# Altium schematic sheet Drone Connector.SchDoc
size A4; Organization: Altium Limited; Address1: L3, 12a Rodborough Rd; Address2: Frenchs Forest; Address3: NSW; Address4: Australia 2086; SheetNumber: 1; SheetTotal: 3
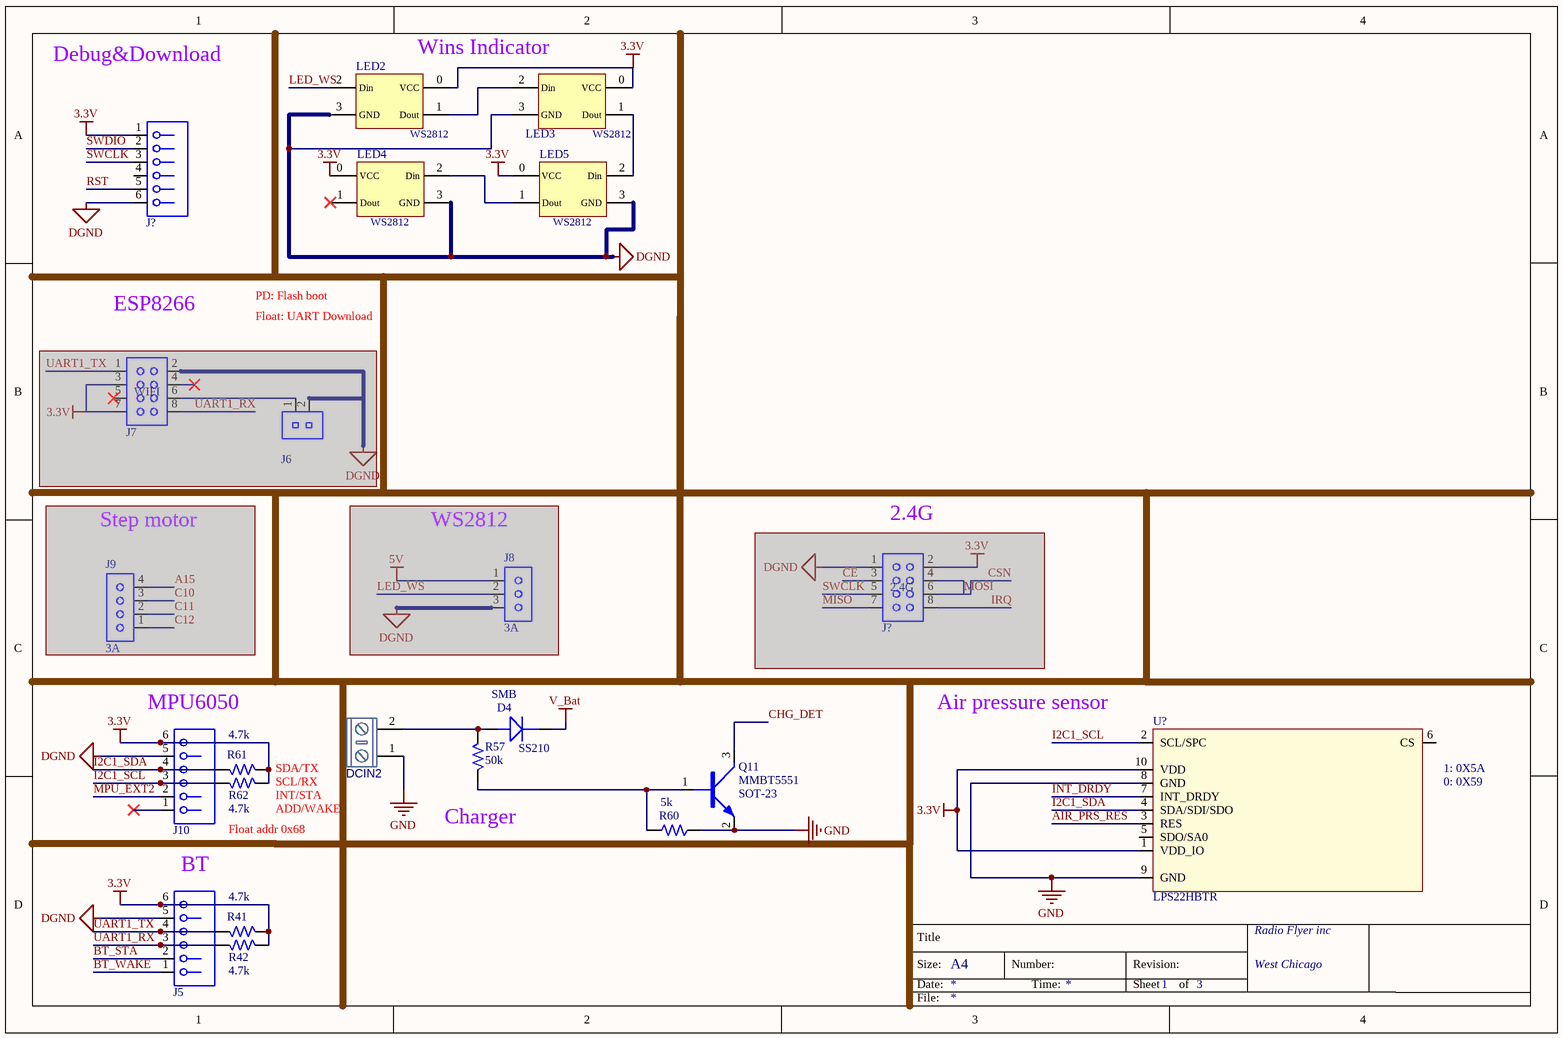
[diagram p0: Drone Connector.SchDoc]

## Parts
(Parts that share a designator on the sheet are numbered #1, #2 ... from top to bottom, then left to right.)
D4  RCD102100-0110  [SMB]  (value not drawn)
DCIN2  KF/WJ/DG 30x connecter  [KF/WJ/DG 301-2p-5.0mm]  (value not drawn)
J5  T690300121600  [CONN 6P PH=2.5mm RA XHB-6AW-KL]  (value not drawn)
J6  CCH254020-0102  [HOUSING 2P PH=2.54mm Jumper]  (value not drawn)  (masked out: inside a compile mask, not in the netlist)
J7  WIFI  [HEAD 8P 2X4 PH=2.54mm 90 H5mm_2.54-2X4AW-10.4]  (masked out: inside a compile mask, not in the netlist)
J8  Current: 3A  [HEAD 3P PH=2.54mm 180]  (hidden comment: CCP254010-0103)  (masked out: inside a compile mask, not in the netlist)
J9  Current: 3A  [HEAD 4P PH=2.54mm 180]  (hidden comment: CCP254260-0104)  (masked out: inside a compile mask, not in the netlist)
J10  T690300121600  [CONN 6P PH=2.5mm RA XHB-6AW-KL]  (value not drawn)
J?#1  T690300121600  [CONN 6P PH=2.5mm RA XHB-6AW-KL]  (value not drawn)
J?#2  2.4G  [HEAD 8P 2X4 PH=2.54mm 90 H5mm_2.54-2X4AW-10.4]  (masked out: inside a compile mask, not in the netlist)
LED2  WS2812  [WS2812]  (value not drawn)
LED3  WS2812  [WS2812]  (value not drawn)
LED4  WS2812  [WS2812]  (value not drawn)
LED5  WS2812  [WS2812]  (value not drawn)
Q11  Package: SOT-23  [SOT23-132-RW]  (hidden comment: RCN005551-0001)
R41  value 4.7k  [0603-RW]  (hidden comment: T5024421083A9)
R42  value 4.7k  [0603-RW]  (hidden comment: T5024421083A9)
R57  value 50k  [0603-RW]  (hidden comment: T5024421083A9)
R60  value 5k  [0603-RW]  (hidden comment: T5024421083A9)
R61  value 4.7k  [0603-RW]  (hidden comment: T5024421083A9)
R62  value 4.7k  [0603-RW]  (hidden comment: T5024421083A9)
U?  MFG Part: LPS22HBTR  [MSOP-10]  (hidden comment: T610300101698)

## Nets
3.3V: J5.6 J10.6 J?#1.1 LED2.0(VCC) LED3.0(VCC) LED4.0(VCC) LED5.0(VCC) R41.2 R42.2 R61.2 R62.2 U?.1(VDD_IO) U?.10(VDD)
DGND: J5.5 J10.5 J?#1.6 LED2.3(GND) LED3.3(GND) LED4.3(GND) LED5.3(GND)
GND: DCIN2.1 Q11.2(E) R60.2 U?.8(GND) U?.9(GND)
V_Bat: D4.2(K)
AIR_PRS_RES: U?.3(RES)
BT_STA: J5.2
BT_WAKE: J5.1
CHG_DET: Q11.3(C)
I2C1_SCL: J10.3 R62.1 U?.2(SCL/SPC)
I2C1_SDA: J10.4 R61.1 U?.4(SDA/SDI/SDO)
INT_DRDY: U?.7(INT_DRDY)
LED_WS: LED2.2(Din)
MPU_EXT2: J10.2
RST: J?#1.5
SWCLK: J?#1.3
SWDIO: J?#1.2
UART1_RX: J5.3 R42.1
UART1_TX: J5.4 R41.1
NetD4_1: D4.1(A) DCIN2.2 R57.1
NetLED2_1: LED2.1(Dout) LED3.2(Din)
NetLED3_1: LED3.1(Dout) LED5.2(Din)
NetLED4_2: LED4.2(Din) LED5.1(Dout)
NetQ11_1: Q11.1(B) R57.2 R60.1

Not connected (* = marked no-connect by the designer): J10 1*; J?#1 4; LED4 1(Dout)*; U? 5(SDO/SA0) 6(CS)

## Notes on the sheet
- Debug&Download
- Wins Indicator
- ESP8266
- PD: Flash boot
- Float: UART Download
- (near J?#2) 2.4G
- Step motor
- (near J8) WS2812
- (near J10) MPU6050
- (near U?) Air pressure sensor
- SDA/TX
- SCL/RX
- (near U?) 1: 0X5A
- (near U?) 0: 0X59
- Float addr 0x68
- INT/STA
- ADD/WAKE
- (near R57) Charger
- BT
- Title
- Size:
- Date:
- A4
- Number:
- Time:
- Revision:
- Sheet
- of
- Radio Flyer inc
- West Chicago
- File:

## Library data of the parts
D4 = SS210: SWITC 100V 2A SS210 MIC G; SAP: T572005362246; Vendor Name: 深圳市春明电子有限公司; Vendor Code: 10020343; Type: DIODE; Optional: USD (和572004962246 交易幣別不一樣)帋ISHIDDEN=T|IS|IS|IS|IS|IS|IS; DIP&SMD: SMD; MFG: MIC; Voltage: 100V; Current: 2A; Customer Specific: N/A; MFG Part: SS210; Package: SMB
DCIN2 = KF/WJ/DG 30x: 接线端子 2Pin
J5 J10 J?#1 = CONN PH 6P PH=2.5mm RA XHB-6AW-KL: CONNECTOR 6PIN P=2.5 WHITE 90 K; Value: 2.5mm; MFG: 金佳电子; CREATE_NAME: Nathan; DIP&SMD: DIP; SAP: T690300121600; MFG Part: XHB-6AW-KL; Vendor Name: *; Vendor Code: *; Type: Connector; Current: *; CREATE_TIME: 27-Sep-2017
J6 = HOUSING 2P PH=2.54mm Jumper: HOUSING SIL Jumper 2P 90059-1007 Molex; Value: 2.54mm; SAP: T690300000900; Vendor Name: 深圳市利民丰电子有限公司; Vendor Code: 10020373; DIP&SMD: DIP; Current: 3A Jumper; MFG: *; MFG Part: *; Type: Connector
J7 J?#2 = HEAD 8P 2X4 PH=2.54mm 90 H5mm_2.54-2X4AW-10.4: 2X4P P:2.54MM 90° DIP K; Value: 2.54mm; SAP: T690300110000; MFG: JINJIA; CREATE_NAME: Nathan; MFG Part: 2.54-2X4AW-10.4; Vendor Name: *; Vendor Code: *; Type: Connector; Current: *; CREATE_TIME: 12-Sep-2017; DIP&SMD: DIP
J8 = HEAD 3P PH=2.54mm 180: HEAD PIN 3P P2.54*H11.6MM; Value: 2.54mm; SAP: T690300031100; Vendor Name: 深圳市利民丰电子有限公司; Vendor Code: 10020373; DIP&SMD: DIP; MFG: *; MFG Part: *; Type: Connector
J9 = HEAD 4P PH=2.54mm 180 H11.5mm: HEAD PIN 4P P2.54xH11.5MM; Value: 2.54mm; SAP: T690300023200; Vendor Name: 亿源电子有限公司; Vendor Code: 10009989; DIP&SMD: DIP; MFG: *; MFG Part: *; Type: Connector
Q11 = MMBT5551: XISTR NPN MMBT5551 SOT-23 FAIRCHILD; SAP: T581001790453; MFG: 宣瑜; Vendor Code: 10020343; Vendor Name: 深圳市春明电子有限公司; DIP&SMD: SMD; Power: *; Voltage: *; Type: NPN; Customer Specific: N/A; MFG Part: MMBT5551
R41 R42 R57 R60-R62 = RES0201 1/20W 1% 4.42K OHM_WALSIN: CHIP 4.42K OHM 200PPM +-1% 0201 WALS L; MFG Part: WR02X4421FAL; Power: 1/20W; MFG: WALSIN (華新); TOL: 1%; CREATE_NAME: Nathan; DIP&SMD: SMD; Vendor Code: *; SAP: T5024421083A9; Vendor Name: *; Type: Resistor; PACKAGE: 0603; CREATE_TIME: 23-July-2019; Customer Specific: N/A
U? = WT51F108S-MG10BWT: MCU WT51F108S-MG10BWT MSOP WELTREN K; MFG: Weltrend; CREATE_NAME: Nathan; DIP&SMD: SMD; Vendor Code: *; Vendor Name: *; SAP: T610300101698; Type: IC; CREATE_TIME: 04-Mar-2019; Customer Specific: N/A